# Altium schematic sheet [1] MCU and BLE.SchDoc
size A4
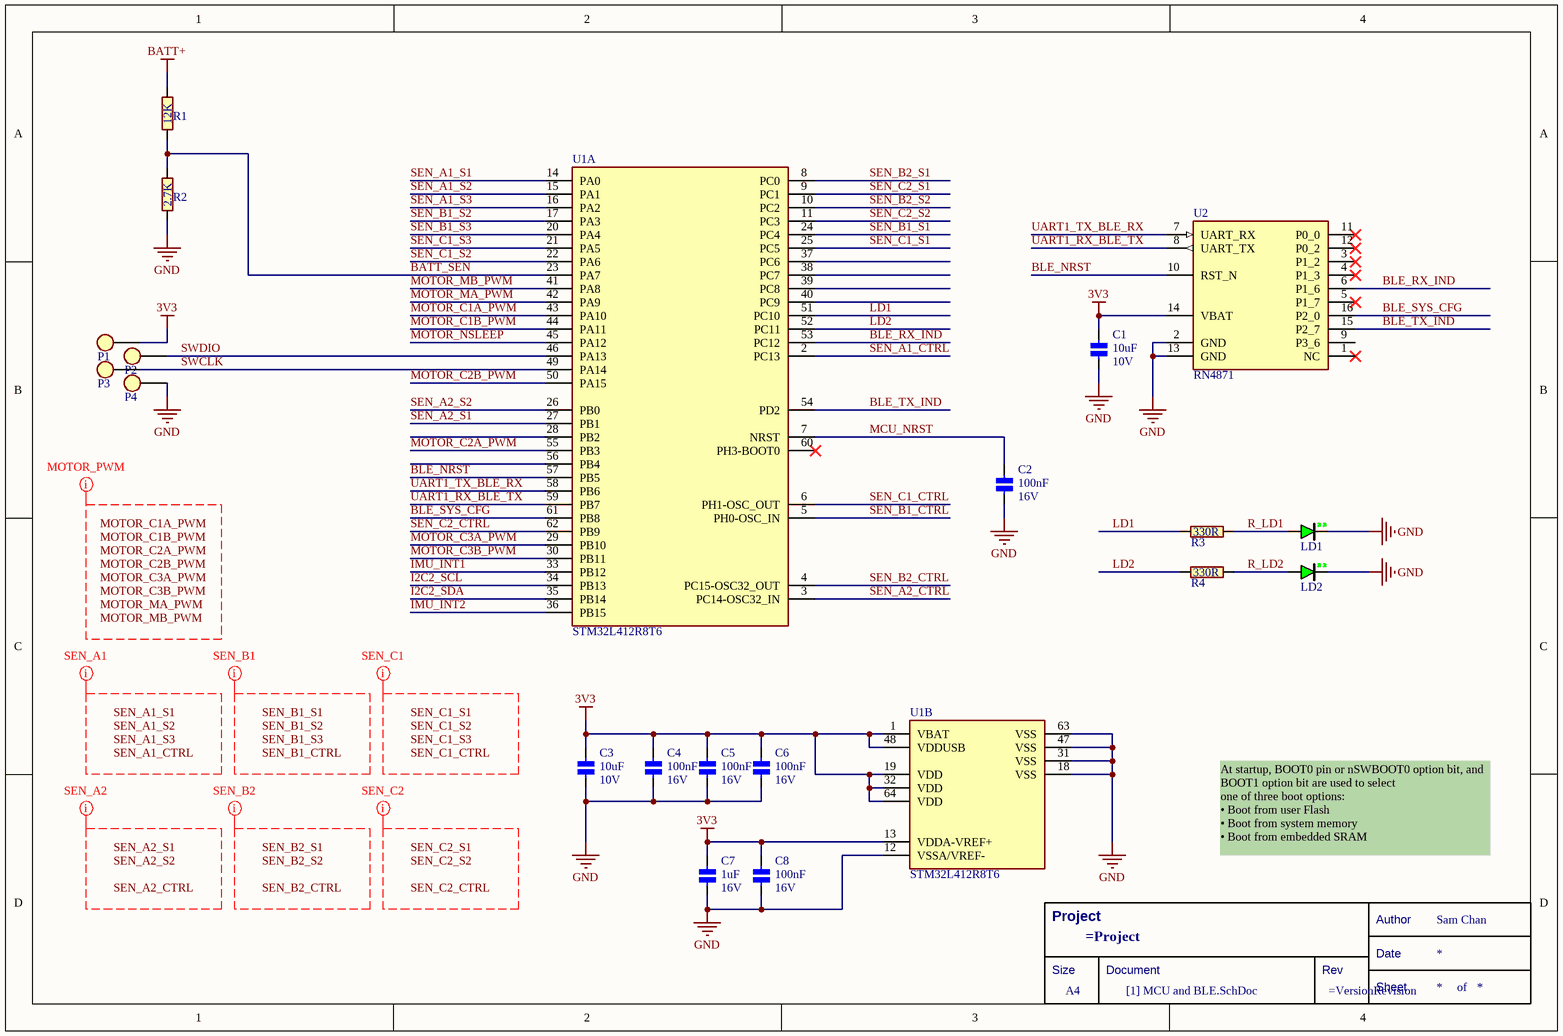
[diagram p0: [1] MCU and BLE.SchDoc]

## Parts
*  Title Block  (value not drawn)  (graphical)
C1  Voltage - Rated: 10V  [CAPC0402X05N]  (hidden comment: 10uF)
C2  Voltage - Rated: 16V  [CAPC0402X05N]  (hidden comment: 100nF)
C3  Voltage - Rated: 10V  [CAPC0402X05N]  (hidden comment: 10uF)
C4  Voltage - Rated: 16V  [CAPC0402X05N]  (hidden comment: 100nF)
C5  Voltage - Rated: 16V  [CAPC0402X05N]  (hidden comment: 100nF)
C6  Voltage - Rated: 16V  [CAPC0402X05N]  (hidden comment: 100nF)
C7  Voltage - Rated: 16V  [CAPC0402X05N]  (hidden comment: 1uF)
C8  Voltage - Rated: 16V  [CAPC0402X05N]  (hidden comment: 100nF)
LD1  Green  [LEDM0603X08N_GREEN]  (value not drawn)
LD2  Green  [LEDM0603X08N_GREEN]  (value not drawn)
P1  PAD_3  [PAD_ROUND_1MM]  (value not drawn)  (no BOM)
P2  PAD_3  [PAD_ROUND_1MM]  (value not drawn)  (no BOM)
P3  PAD_3  [PAD_ROUND_1MM]  (value not drawn)  (no BOM)
P4  PAD_3  [PAD_ROUND_1MM]  (value not drawn)  (no BOM)
R1  12K  [RESC0402X04N]
R2  2.7K  [RESC0402X04N]
R3  330R  [RESC0402X04N]
R4  330R  [RESC0402X04N]
U1  STM32L412R8T6  [STM32L412R]  (parts A,B of 2)
U2  RN4871  [RN4871]

## Nets
3V3: C1.1 C3.1 C4.1 C5.1 C6.1 C7.1 C8.1 P1.1 U1.1(VBAT) U1.13(VDDA-VREF+) U1.19(VDD) U1.32(VDD) U1.48(VDDUSB) U1.64(VDD) U2.14(VBAT)
BATT+: R1.2
GND: C1.2 C2.2 C3.2 C4.2 C5.2 C6.2 C7.2 C8.2 LD1.2 LD2.2 P4.1 R2.1 U1.12(VSSA/VREF-) U1.18(VSS) U1.31(VSS) U1.47(VSS) U1.63(VSS) U2.2(GND) U2.13(GND)
BATT_SEN: R1.1 R2.2 U1.23(PA7)
BLE_NRST: U1.57(PB5) U2.10(RST_N)
BLE_RX_IND: U1.53(PC12) U2.6(P1_6)
BLE_SYS_CFG: U1.61(PB8) U2.16(P2_0)
BLE_TX_IND: U1.54(PD2) U2.15(P2_7)
I2C2_SCL: U1.34(PB13)
I2C2_SDA: U1.35(PB14)
IMU_INT1: U1.33(PB12)
IMU_INT2: U1.36(PB15)
LD1: R3.1 U1.51(PC10)
LD2: R4.1 U1.52(PC11)
MCU_NRST: C2.1 U1.7(NRST)
MOTOR_C1A_PWM: U1.43(PA10)
MOTOR_C1B_PWM: U1.44(PA11)
MOTOR_C2A_PWM: U1.55(PB3)
MOTOR_C2B_PWM: U1.50(PA15)
MOTOR_C3A_PWM: U1.29(PB10)
MOTOR_C3B_PWM: U1.30(PB11)
MOTOR_MA_PWM: U1.42(PA9)
MOTOR_MB_PWM: U1.41(PA8)
MOTOR_NSLEEP: U1.45(PA12)
R_LD1: LD1.1 R3.2
R_LD2: LD2.1 R4.2
SEN_A1_CTRL: U1.2(PC13)
SEN_A1_S1: U1.14(PA0)
SEN_A1_S2: U1.15(PA1)
SEN_A1_S3: U1.16(PA2)
SEN_A2_CTRL: U1.3(PC14-OSC32_IN)
SEN_A2_S1: U1.27(PB1)
SEN_A2_S2: U1.26(PB0)
SEN_B1_CTRL: U1.5(PH0-OSC_IN)
SEN_B1_S1: U1.24(PC4)
SEN_B1_S2: U1.17(PA3)
SEN_B1_S3: U1.20(PA4)
SEN_B2_CTRL: U1.4(PC15-OSC32_OUT)
SEN_B2_S1: U1.8(PC0)
SEN_B2_S2: U1.10(PC2)
SEN_C1_CTRL: U1.6(PH1-OSC_OUT)
SEN_C1_S1: U1.25(PC5)
SEN_C1_S2: U1.22(PA6)
SEN_C1_S3: U1.21(PA5)
SEN_C2_CTRL: U1.62(PB9)
SEN_C2_S1: U1.9(PC1)
SEN_C2_S2: U1.11(PC3)
SWCLK: P3.1 U1.49(PA14)
SWDIO: P2.1 U1.46(PA13)
UART1_RX_BLE_TX: U1.59(PB7) U2.8(UART_TX)
UART1_TX_BLE_RX: U1.58(PB6) U2.7(UART_RX)

Not connected (* = marked no-connect by the designer): U1 28(PB2) 37(PC6) 38(PC7) 39(PC8) 40(PC9) 56(PB4) 60(PH3-BOOT0)*; U2 1(NC)* 3(P1_2)* 4(P1_3)* 5(P1_7)* 9(P3_6) 11(P0_0)* 12(P0_2)*

## Layout directives
net class MOTOR_PWM: MOTOR_C1A_PWM, MOTOR_C1B_PWM, MOTOR_C2A_PWM, MOTOR_C2B_PWM, MOTOR_C3A_PWM, MOTOR_C3B_PWM, MOTOR_MA_PWM, MOTOR_MB_PWM
net class SEN_A1: SEN_A1_CTRL, SEN_A1_S1, SEN_A1_S2, SEN_A1_S3
net class SEN_A2: SEN_A2_CTRL, SEN_A2_S1, SEN_A2_S2
net class SEN_B1: SEN_B1_CTRL, SEN_B1_S1, SEN_B1_S2, SEN_B1_S3
net class SEN_B2: SEN_B2_CTRL, SEN_B2_S1, SEN_B2_S2
net class SEN_C1: SEN_C1_CTRL, SEN_C1_S1, SEN_C1_S2, SEN_C1_S3
net class SEN_C2: SEN_C2_CTRL, SEN_C2_S1, SEN_C2_S2

## Notes on the sheet
- At startup, BOOT0 pin or nSWBOOT0 option bit, and BOOT1 option bit are used to select
  one of three boot options:
  • Boot from user Flash
  • Boot from system memory
  • Boot from embedded SRAM
- Labels drawn without touching a wire or pin: MOTOR_C1A_PWM, MOTOR_C1B_PWM, MOTOR_C2A_PWM, MOTOR_C2B_PWM, MOTOR_C3A_PWM, MOTOR_C3B_PWM, MOTOR_MA_PWM, MOTOR_MB_PWM, SEN_A1_CTRL, SEN_A1_S1, SEN_A1_S2, SEN_A1_S3, SEN_A2_CTRL, SEN_A2_S1, SEN_A2_S2, SEN_B1_CTRL, SEN_B1_S1, SEN_B1_S2, SEN_B1_S3, SEN_B2_CTRL, SEN_B2_S1, SEN_B2_S2, SEN_C1_CTRL, SEN_C1_S1, SEN_C1_S2, SEN_C1_S3, SEN_C2_CTRL, SEN_C2_S1, SEN_C2_S2
- (in symbol Title Block) Project; Author; Sam Chan; Date; Size; Document; Rev; A4; Sheet; of

## Library data of the parts
* = Title Block: Standard Title Block
C1 C3 = CER 10UF 10V: CAP CER 10UF 10V X5R 0402; Manufacturer: Murata Electronics; Manufacturer Part Number: GRM155R61A106ME44D; Category: Capacitors; Supplier 1: LCSC; Supplier Part Number 1: C77000; Package / Case: 0402; Capacitance: 10uF
C2 C4-C6 C8 = CER 100NF 16V: CAP CER 0.1UF 16V X7R 0402; Manufacturer: Samsung Electro-Mechanics; Manufacturer Part Number: CL05B104KO5NNNC; Category: Capacitors; Supplier 1: LCSC; Supplier Part Number 1: C1525; Package / Case: 0402; Capacitance: 100nF
C7 = CER 1UF 16V: CAP CER 1UF 16V X5R 0402; Manufacturer: Samsung Electro-Mechanics; Manufacturer Part Number: CL05A105KO5NNNC; Category: Capacitors; Supplier 1: LCSC; Supplier Part Number 1: C29266; Package / Case: 0402; Capacitance: 1uF
LD1 LD2 = LED 0603 GREEN: LED GREEN CLEAR CHIP SMD; Manufacturer: Lite-On Inc.; Manufacturer Part Number: LTST-C190KGKT; Category: LED; Package / Case: 0603 (1608 Metric); Color: Green; Supplier 1: LCSC; Supplier Part Number 1: C125094
P1-P4 = PAD_3: a Round Pad 1mm
R1 = RES 12K: RES SMD 12K OHM 1% 1/16W 0402; Manufacturer: YAGEO; Manufacturer Part Number: RC0402FR-0712KL; Category: Resistors; Package / Case: 0402; Supplier 1: LCSC; Supplier Part Number 1: C114760; Resistance: 12K
R2 = RES 2.7K: RES SMD 2.7K OHM 1% 1/16W 0402; Manufacturer: YAGEO; Manufacturer Part Number: AC0402FR-072K7L; Category: Resistors; Package / Case: 0402; Supplier 1: LCSC; Supplier Part Number 1: C144771; Resistance: 2.7K
R3 R4 = RES 330R: RES SMD 330R OHM 1% 1/16W 0402; Manufacturer: YAGEO; Manufacturer Part Number: RC0402FR-07330RL; Category: Resistors; Package / Case: 0402; Supplier 1: LCSC; Supplier Part Number 1: C105875; Resistance: 330R
U1 = STM32L412R8T6: ARM® Cortex®-M4 STM32L4 Microcontroller IC 32-Bit 80MHz 64KB (64K x 8) FLASH 64-LQFP (10x10); Manufacturer: STMicroelectronics; Categories: Microcontrollers; Manufacturer Part Number: STM32L412R8T6; Case: 64-LQFP (10x10); Notes: -
U2 = RN4871: Bluetooth Bluetooth v5.0 Transceiver Module 2.4GHz Integrated, Chip Surface Mount; Manufacturer: Microchip Technology; Manufacturer Part Number: RN4871-I/RM130; Categories: RF Transceiver Modules; Case: 16-SMD Module